# EAGLE design Carrier Board (EAGLE 9.4.0)

## Sheet 1 of 3: Sensors
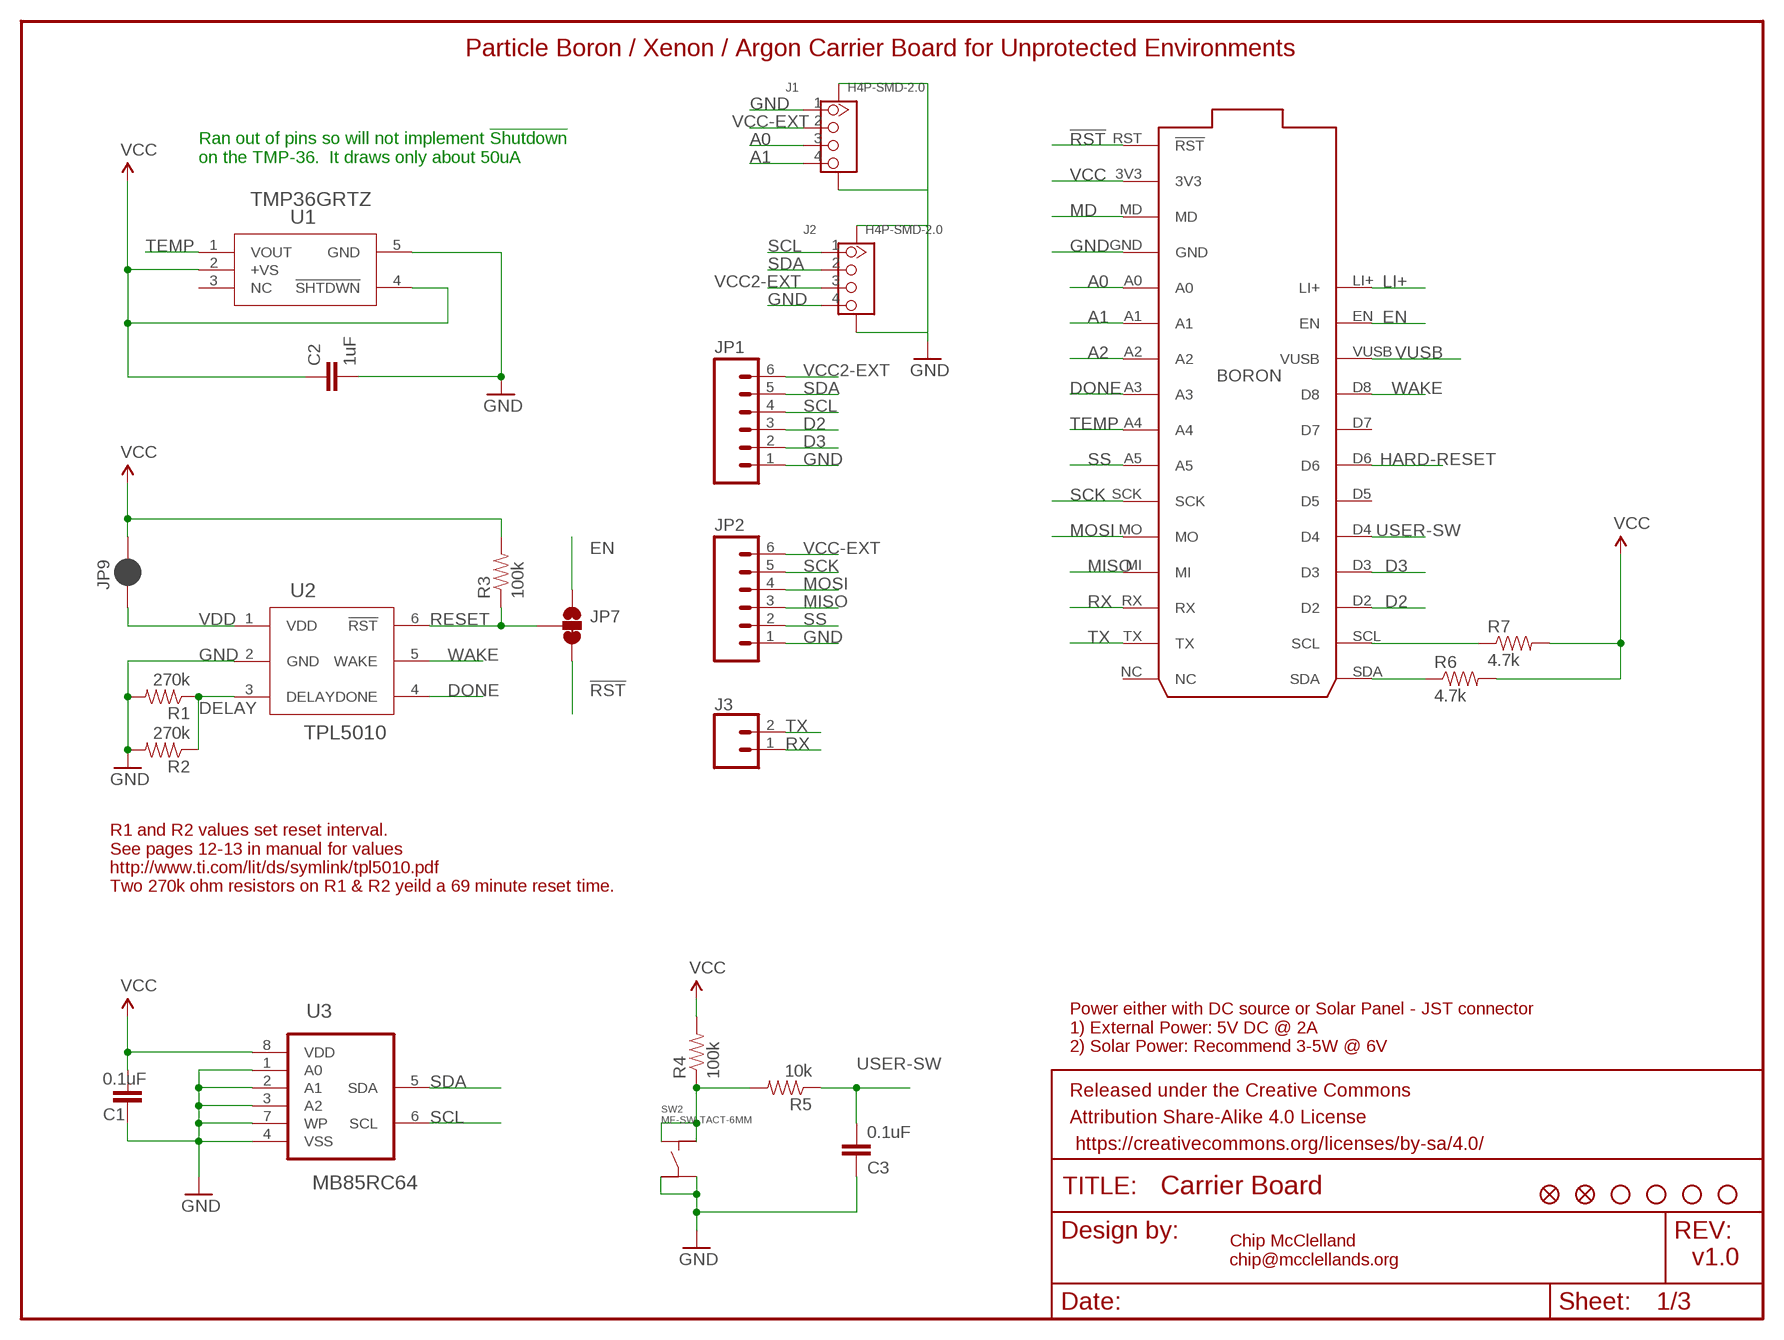
[diagram p0: schematic, sheet 1]

### Parts
BORON/ARGON/XENON  PARTICLE-DEVICES-BORON  [PARTICLE-DEVICES_BORON]
C1  0.1uF  CAP0805  [0805@1]
C2  1uF  CAP0805  [0805@1]
C3  0.1uF  CAP0805  [0805@1]
FD1  FIDUCIALUFIDUCIAL  [FIDUCIAL-MICRO]
FD2  FIDUCIALUFIDUCIAL  [FIDUCIAL-MICRO]
FRAME1  FRAME-LETTER  [CREATIVE_COMMONS]
J1  H4P-SMD-2.0  GROVE-CONNECTOR-SMD(4+2P-2.0)  [HW4-SMD-2.0]
J2  H4P-SMD-2.0  GROVE-CONNECTOR-SMD(4+2P-2.0)  [HW4-SMD-2.0]
J3  CONN_02  [1X02]
JP1  M06LOCK  [1X06_LOCK]
JP2  M06LOCK  [1X06_LOCK]
JP3  STAND-OFF  [STAND-OFF]
JP4  STAND-OFF  [STAND-OFF]
JP5  STAND-OFF  [STAND-OFF]
JP6  STAND-OFF  [STAND-OFF]
JP7  JUMPER-SMT_3_1-NC_TRACE_SILK  [SMT-JUMPER_3_1-NC_TRACE_SILK]
JP9  JUMPER-SMT_2_NC_PASTE_SILK  [SMT-JUMPER_2_NC_PASTE_SILK]
R1  270k  RESISTOR0805-RES  [0805]
R2  270k  RESISTOR0805-RES  [0805]
R3  100k  RESISTOR0805-RES  [0805]
R4  100k  RESISTOR0805-RES  [0805]
R5  10k  RESISTOR0805-RES  [0805]
R6  4.7k  RESISTOR0805-RES  [0805]
R7  4.7k  RESISTOR0805-RES  [0805]
SW2  MF-SW-TACT-6MM  TACT_6MM  [TACT6MM]
U1  TMP36GRTZ  TMP36GRTZ-REEL7  [RJ_5]
U2  TPL5010  [TSOT-23]
U3  MB85RC64  MB85RC128PNF-G-JNE1  [SOIC127P600X175-8N]

### Nets
!RST: BORON/ARGON/XENON.RST(!RST) JP7.3
A0: BORON/ARGON/XENON.A0 J1.3
A1: BORON/ARGON/XENON.A1 J1.4
A2: BORON/ARGON/XENON.A2
D2: BORON/ARGON/XENON.D2 JP1.3 ; also sheet 3
D3: BORON/ARGON/XENON.D3 JP1.2 ; also sheet 3
DELAY: R1.1 R2.1 U2.3(DELAY)
DONE: BORON/ARGON/XENON.A3 U2.4(DONE)
EN: BORON/ARGON/XENON.EN JP7.1 ; also sheet 2
GND: BORON/ARGON/XENON.GND C1.2 C2.2 C3.2 J1.1 J1.SS1 J1.SS2 J2.4 J2.SS1 J2.SS2 JP1.1 JP2.1 R1.2 R2.2 SW2.P$3 SW2.P$4 U1.5(GND) U2.2(GND) U3.1(A0) U3.2(A1) U3.3(A2) U3.4(VSS) U3.7(WP) ; also sheet 2,3
HARD-RESET: BORON/ARGON/XENON.D6 ; also sheet 2
LI+: BORON/ARGON/XENON.LI+ ; also sheet 2,3
MD: BORON/ARGON/XENON.MD
MISO: BORON/ARGON/XENON.MI JP2.3
MOSI: BORON/ARGON/XENON.MO JP2.4
N$4: R4.1 R5.2 SW2.P$1 SW2.P$2
RESET: JP7.2 R3.1 U2.6(!RST)
RX: BORON/ARGON/XENON.RX J3.1
SCK: BORON/ARGON/XENON.SCK JP2.5
SCL: BORON/ARGON/XENON.SCL J2.1 JP1.4 R7.1 U3.6(SCL) ; also sheet 3
SDA: BORON/ARGON/XENON.SDA J2.2 JP1.5 R6.1 U3.5(SDA) ; also sheet 3
SS: BORON/ARGON/XENON.A5 JP2.2
TEMP: BORON/ARGON/XENON.A4 U1.1(VOUT)
TX: BORON/ARGON/XENON.TX J3.2
USER-SW: BORON/ARGON/XENON.D4 C3.1 R5.1
VCC: BORON/ARGON/XENON.3V3 C1.1 C2.1 JP9.2 R3.2 R4.2 R6.2 R7.2 U1.2(+VS) U1.4(!SHTDWN) U3.8(VDD) ; also sheet 3
VCC2-EXT: J2.3 JP1.6 ; also sheet 3
VCC-EXT: J1.2 JP2.6 ; also sheet 3
VDD: JP9.1 U2.1(VDD)
VUSB: BORON/ARGON/XENON.VUSB ; also sheet 2,3
WAKE: BORON/ARGON/XENON.D8 U2.5(WAKE)
Unconnected: BORON/ARGON/XENON.D5 BORON/ARGON/XENON.D7 BORON/ARGON/XENON.NC U1.3(NC)

### Notes on the sheet
- Particle Boron / Xenon / Argon Carrier Board for Unprotected Environments
- Ran out of pins so will not implement !Shutdown
  on the TMP-36.  It draws only about 50uA
- R1 and R2 values set reset interval.
  See pages 12-13 in manual for values
  http://www.ti.com/lit/ds/symlink/tpl5010.pdf
  Two 270k ohm resistors on R1 & R2 yeild a 69 minute reset time.
- Power either with DC source or Solar Panel - JST connector
  1) External Power: 5V DC @ 2A 
  2) Solar Power: Recommend 3-5W @ 6V
- Chip McClelland
  chip@mcclellands.org
- v1.0

## Sheet 2 of 3: Power Control
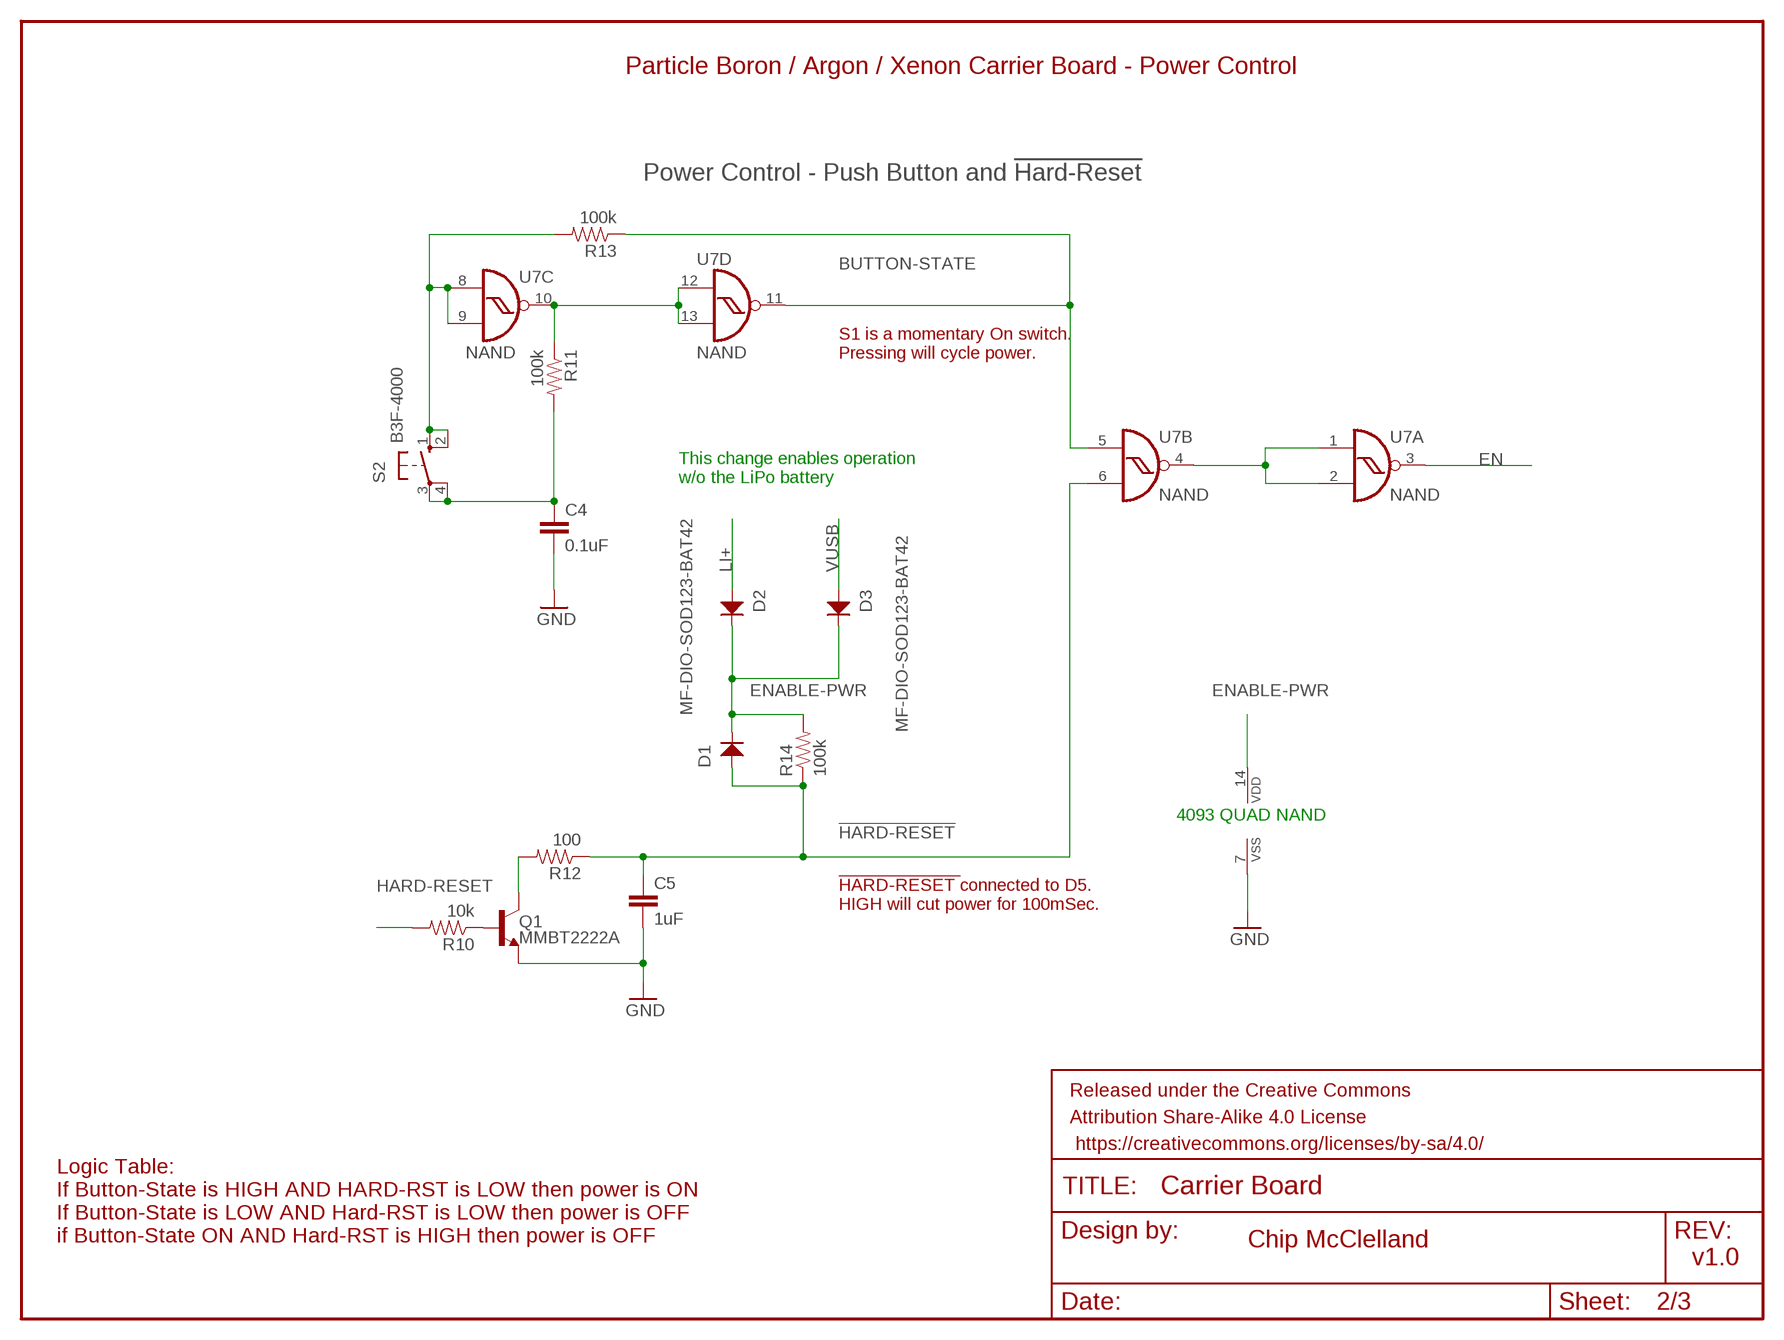
[diagram p1: schematic, sheet 2]

### Parts
C4  0.1uF  CAP0805  [0805@1]
C5  1uF  CAP0805  [0805@1]
D1  MF-DIO-SOD123-BAT42  DIODES_BAT42_SOD-123  [SOD-123]
D2  MF-DIO-SOD123-BAT42  DIODES_BAT42_SOD-123  [SOD-123]
D3  MF-DIO-SOD123-BAT42  DIODES_BAT42_SOD-123  [SOD-123]
FRAME2  FRAME-LETTER  [CREATIVE_COMMONS]
Q1  MMBT2222A  TRANS_NPN-MMBT2222AL  [SOT23-3]
R10  10k  RESISTOR0805-RES  [0805]
R11  100k  RESISTOR0805-RES  [0805]
R12  100  RESISTOR0805-RES  [0805]
R13  100k  RESISTOR0805-RES  [0805]
R14  100k  RESISTOR0805-RES  [0805]
S2  B3F-4000  40-XX-ROUND  [B3F-40XX-ROUND]
U7  NAND  4093DT  [MC14093B-TSSOP14]

### Nets
!HARD-RESET: C5.1 D1.ANODE R12.1 R14.1 U7.6(B:I1)
BUTTON-STATE: R13.1 U7.5(B:I0) U7.11(D:O)
EN: U7.3(A:O) ; also sheet 1
ENABLE-PWR: D1.CATHODE D2.CATHODE D3.CATHODE R14.2 U7.14(P:VDD)
GND: C4.2 C5.2 Q1.2(E) U7.7(P:VSS) ; also sheet 1,3
HARD-RESET: R10.2 ; also sheet 1
LI+: D2.ANODE ; also sheet 1,3
N$1: U7.1(A:I0) U7.2(A:I1) U7.4(B:O)
N$14: R11.1 U7.10(C:O) U7.12(D:I0) U7.13(D:I1)
N$16: Q1.1(B) R10.1
N$19: Q1.3(C) R12.2
N$24: C4.1 R11.2 S2.3(P) S2.4(P1)
N$25: R13.2 S2.1(S) S2.2(S1) U7.8(C:I0) U7.9(C:I1)
VUSB: D3.ANODE ; also sheet 1,3

### Notes on the sheet
- Particle Boron / Argon / Xenon Carrier Board - Power Control
- Power Control - Push Button and !Hard-Reset
- S1 is a momentary On switch.
  Pressing will cycle power.
- This change enables operation 
  w/o the LiPo battery
- 4093 QUAD NAND
- !HARD-RESET !connected to D5. 
  HIGH will cut power for 100mSec.
- Chip McClelland
- Logic Table:
  If Button-State is HIGH AND HARD-RST is LOW then power is ON
  If Button-State is LOW AND Hard-RST is LOW then power is OFF
  if Button-State ON AND Hard-RST is HIGH then power is OFF
- v1.0

## Sheet 3 of 3: Protection and 5V Boost
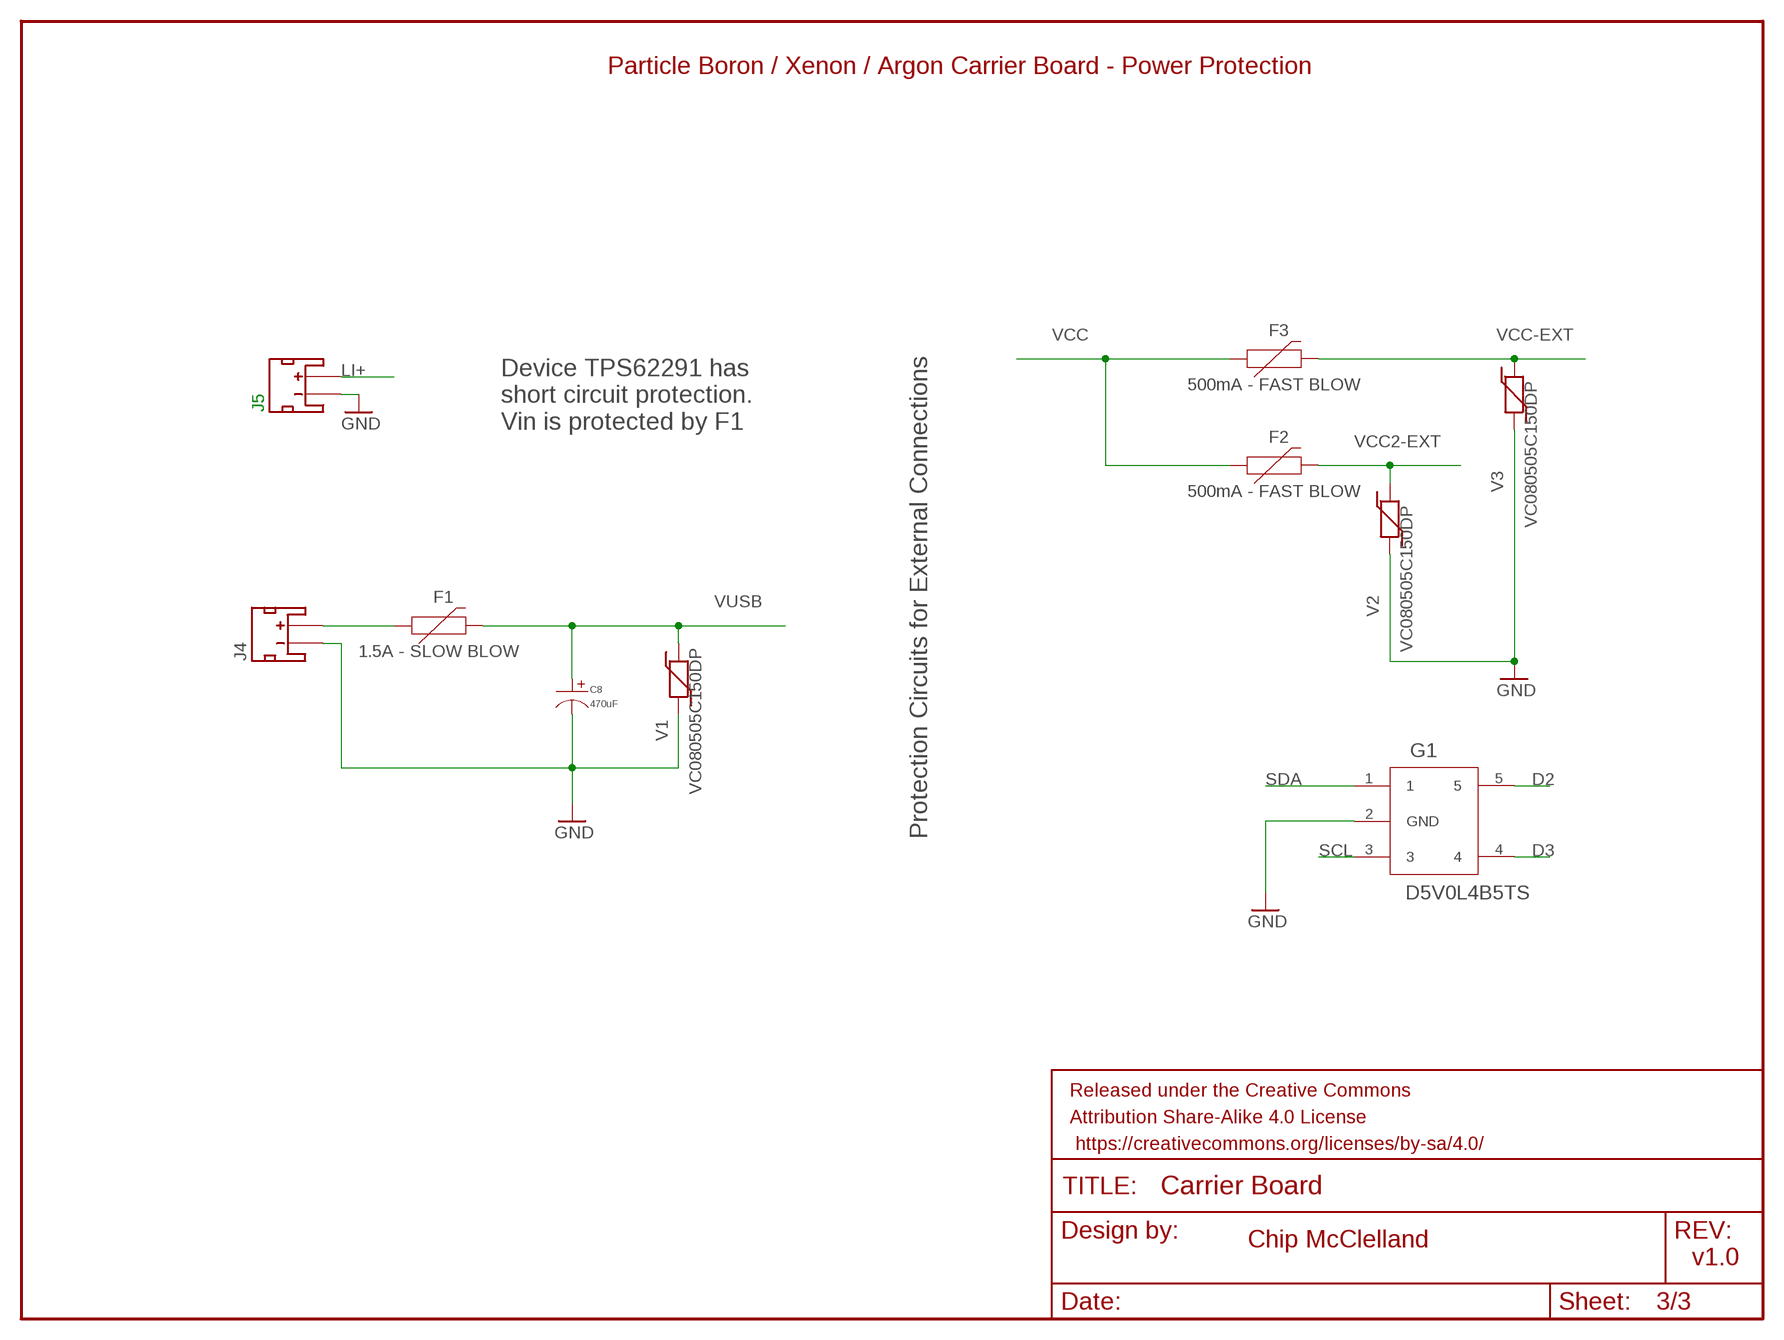
[diagram p2: schematic, sheet 3]

### Parts
C8  470uF  CAPACITOR_P_10MM  [CP10MM]
F1  1.5A - SLOW BLOW  PPTC_HALF-AMP  [1206]
F2  500mA - FAST BLOW  PPTC_HALF-AMP  [1206]
F3  500mA - FAST BLOW  PPTC_HALF-AMP  [1206]
FRAME3  FRAME-LETTER  [CREATIVE_COMMONS]
G1  D5V0L4B5TS  [SOT-23-5]
J4  S2B-PH-SM4-TB(LF)(SN)  JST_2MM_MALE  [JST-2-SMD]
J5  S2B-PH-SM4-TB(LF)(SN)  JST_2MM_MALE  [JST-2-SMD]
V1  VC080505C150DP  VARISTOR  [0805]
V2  VC080505C150DP  VARISTOR  [0805]
V3  VC080505C150DP  VARISTOR  [0805]

### Nets
D2: G1.5 ; also sheet 1
D3: G1.4 ; also sheet 1
DC-IN-EXT: F1.1 J4.2(+)
GND: C8.P$2 G1.2(GND) J4.1(-) J5.1(-) V1.1 V2.1 V3.1 ; also sheet 1,2
LI+: J5.2(+) ; also sheet 1,2
SCL: G1.3 ; also sheet 1
SDA: G1.1 ; also sheet 1
VCC: F2.1 F3.1 ; also sheet 1
VCC2-EXT: F2.2 V2.2 ; also sheet 1
VCC-EXT: F3.2 V3.2 ; also sheet 1
VUSB: C8.P$1 F1.2 V1.2 ; also sheet 1,2
Unconnected: J4.NC1(PAD1) J4.NC2(PAD2) J5.NC1(PAD1) J5.NC2(PAD2)

### Notes on the sheet
- Particle Boron / Xenon / Argon Carrier Board - Power Protection
- Device TPS62291 has 
  short circuit protection. 
  Vin is protected by F1
- Protection Circuits for External Connections
- Chip McClelland
- v1.0

## Library data of the parts
BORON/ARGON/XENON = Carrier Board:PARTICLE-DEVICES-BORON: Particle Boron Device for Carrier Board Placement
C1-C5 = SparkFun-Capacitors:CAP: Capacitor Standard 0603 ceramic capacitor, and 0.1" leaded capacitor.
C8 = MF_Passives:CAPACITOR_P: Library: MF_Passives Description: Device for Polarized Capacitors. Manufacture part number (MPN), Voltage Rating, and Tolerance can be added via Attributes. Check https://factory.macrofab.com/parts for the house parts list.; POPULATE: 1
D1-D3 = MF_Discrete_Semiconductor:DIODES: Library: MF_Discrete_Semiconductor Description: Device for Single Packaged Diodes.; HOUSEPART: YES; MPN: MF-DIO-SOD123-BAT42; POPULATE: 1; URL: https://factory.macrofab.com/part/MF-DIO-SOD123-BAT42
F1-F3 = SparkFun-Fuses:PPTC: Resettable Fuse PPTC Resettable Fuse. Really a sort of resistor with a polymeric positive temperature coefficient whose resistance increases dramatically with an increase in temperature. When heated by the power passing through the resistance rises causing the current to be limited, protecting the circuit. This is achieved by the transition of the polymer from a crystalline to an amorphous state where the conductive carbon separates breaking the conductive pathways found in the cool crystalline structure. When a PPTC cools back down it resumes conducting letting the circuit turn back on. SparkFun Products: SparkFun RedBoard - Programmed with Arduino <https://www.sparkfun.com/products/12757> Pro Micro - 5V/16MHz <https://www.sparkfun.com/products/12640> Arduino Pro 328 - 5V/16MHz <https://www.sparkfun.com/products/10915> MP3 Trigger <https://www.sparkfun.com/products/13720>; PROD_ID: RES-08585; VALUE: 6V/0.5A
FD1 FD2 = SparkFun-Aesthetics:FIDUCIAL: Fiducial Alignment Points Point-of-reference for pick-and-place machines and other optical instruments.
FRAME1-FRAME3 = SparkFun-Aesthetics:FRAME-LETTER: Schematic Frame - Letter Standard 8.5x11 US Letter frame
G1 = Custom Components:D5V0L4B5TS: 4 CHANNEL LOW CAPACITANCE BI-DIRECTIONAL TVS ARRAY
J1 J2 = OPL_Connector:GROVE-CONNECTOR-SMD(4+2P-2.0): 320110030
J3 = SparkFun-Connectors:CONN_02: Multi connection point. Often used as Generic Header-pin footprint for 0.1 inch spaced/style header connections On any of the 0.1 inch spaced packages, you can populate with these: Break Away Headers - Straight <https://www.sparkfun.com/products/116> (PRT-00116) Break Away Male Headers - Right Angle <https://www.sparkfun.com/products/553> (PRT-00553) Female Headers <https://www.sparkfun.com/products/115> (PRT-00115) Break Away Headers - Machine Pin <https://www.sparkfun.com/products/117> (PRT-00117) Break Away Female Headers - Swiss Machine Pin <https://www.sparkfun.com/products/743> (PRT-00743) For SCREWTERMINALS and SPRING TERMINALS visit here: Screw Terimnals on SparkFun.com <https://www.sparkfun.com/search/results?term=Screw+Terminals> (5mm/3.5mm/2.54mm spacing) This device is also useful as a general connection point to wire up your design to another part of your project. Our various solder wires solder well into these plated through hole pads. Hook-Up Wire - Assortment (Stranded, 22 AWG) <https://www.sparkfun.com/products/11375> (PRT-11375) Hook-Up Wire - Assortment (Solid Core, 22 AWG) <https://www.sparkfun.com/products/11367> (PRT-11367) View the entire wire category on our website here <https://www.sparkfun.com/categories/141> Special notes: Molex polarized connector foot print use with: PRT-08233 with associated crimp pins and housings. 2.54_SCREWTERM for use with PRT-10571. 3.5mm Screw Terminal footprints for PRT-08084 5mm Screw Terminal footprints for use with PRT-08432
J4 J5 = SparkFun-Connectors:JST_2MM_MALE: JST 2MM MALE RA CONNECTOR Two pin, compact surface mount connector. Commonly used as a battery input connection point. We really like the solid locking feeling and high current rating on these small connectors. We use these all the time as battery connectors. Mates to single-cell LiPo batteries. Here is the connector we sell at SparkFun: JST Right Angle Connector - White <https://www.sparkfun.com/products/8612> (PRT-08612) Datasheet <http://www.sparkfun.com/datasheets/Prototyping/Connectors/JST-Horizontal.pdf> It was used on these SparkFun products: SparkFun MOSFET Power Controller <https://www.sparkfun.com/products/11214> (PRT-11214) SparkFun Battery Babysitter - LiPo Battery Manager <https://www.sparkfun.com/products/13777> (PRT-13777) And many, many others that required a lipo battery connection.; MFG: S2B-PH-SM4-TB(LF)(SN); PROD_ID: CONN-11443; SF_ID: PRT-08612
JP1 JP2 = SparkFun-Connectors:M06: Header 6 Standard 6-pin 0.1" header. Use with straight break away headers (SKU : PRT-00116), right angle break away headers (PRT-00553), swiss pins (PRT-00743), machine pins (PRT-00117), and female headers (PRT-00115). Molex polarized connector foot print use with SKU : PRT-08094 with associated crimp pins and housings. NOTES ON THE VARIANTS LOCK and LOCK_LONGPADS... This footprint was designed to help hold the alignment of a through-hole component (i.e. 6-pin header) while soldering it into place. You may notice that each hole has been shifted either up or down by 0.005 of an inch from it's more standard position (which is a perfectly straight line). This slight alteration caused the pins (the squares in the middle) to touch the edges of the holes. Because they are alternating, it causes a "brace" to hold the component in place. 0.005 has proven to be the perfect amount of "off-center" position when using our standard breakaway headers. Although looks a little odd when you look at the bare footprint, once you have a header in there, the alteration is very hard to notice. Also,if you push a header all the way into place, it is covered up entirely on the bottom side. This idea of altering the position of holes to aid alignment will be further integrated into the Sparkfun Library for other footprints. It can help hold any component with 3 or more connection pins.
JP3-JP6 = SparkFun:STAND-OFF: Stand Off This is the mechanical footprint for a #4 phillips button head screw. Use the keepout ring to avoid running the screw head into surrounding components. SKU : PRT-00447
JP7 = SparkFun-Jumpers:JUMPER-SMT_3_1-NC_TRACE: Normally closed trace jumper (1 of 2 connections) This jumper has a trace between two pads so it's normally closed (NC). The other connection is normally open (NO). Use a razor knife to open the connection. For best results follow the IPC guidelines for cutting traces: Cutout at least 0.063 mm (0.005 in). Remove all loose material to clean up the cut area. Seal the cut with an approved epoxy. Reapply solder to reclose the connection, or to close the NO connection.
JP9 = SparkFun-Jumpers:JUMPER-SMT_2_NC_PASTE: Normally closed solder jumper This jumper has an aperture in the stencil to allow solder paste to bridge the split in the wire so it's normally closed (NC). Wick off the solder to open the connection. Reapply solder to reclose the connection.
Q1 = SparkFun-DiscreteSemi:TRANS_NPN: NPN transistor Current controlled devices typically used to amplify current or used as a switch. BC547 - COM-08928 <http://www.sparkfun.com/products/8928> (TO-92 45V 100mA) (1.Collector 2.Base 3.Emitter) 2N3904 - COM-00521 <http://www.sparkfun.com/products/521> (TO-92 40V 200mA) (1.Emitter 2.Base 3.Collector) P2N2222A - COM-12852 <http://www.sparkfun.com/products/12852> (TO-92 40V 600mA) (1.Collector 2.Base 3.Emitter); PROD_ID: TRANS-08049; VALUE: 600mA/40V
R1-R7 R10-R14 = SparkFun-Passives:RESISTOR: Resistor Basic schematic elements and footprints for 0603, 1206, and PTH resistors.
S2 = adafruit:40-XX: OMRON SWITCH
SW2 = MF_Switches:TACT: Library: MF_Switches Description: Device for Tact Switches. Manufacture part number (MFG#) can be added via Attributes.; HOUSEPART: YES; MPN: MF-SW-TACT-6MM; POPULATE: 1; URL: https://factory.macrofab.com/part/MF-SW-TACT-6MM
U1 = TMP36:TMP36GRTZ-REEL7; MANUFACTURER_PART_NUMBER: TMP36GRTZREEL7; VENDOR: Analog Devices Inc
U2 = Custom Components:TPL5010: This is a TI Ultra-Low-Power External watchdog.
U3 = Fujitsu_By_element14_Batch_1:MB85RC128PNF-G-JNE1: Memory FRAM; MPN: MB85RC128PNF-G-JNE1; OC_FARNELL: 1831995; OC_NEWARK: 93R5161; PACKAGE: SO-8; SUPPLIER: FUJITSU
U7 = adafruit:4093: Quad 2-input NAND schmitt trigger
V1-V3 = Custom Components:VARISTOR

## Net classes
0 default: width 0.203 mm, drill 0.33 mm

## Board
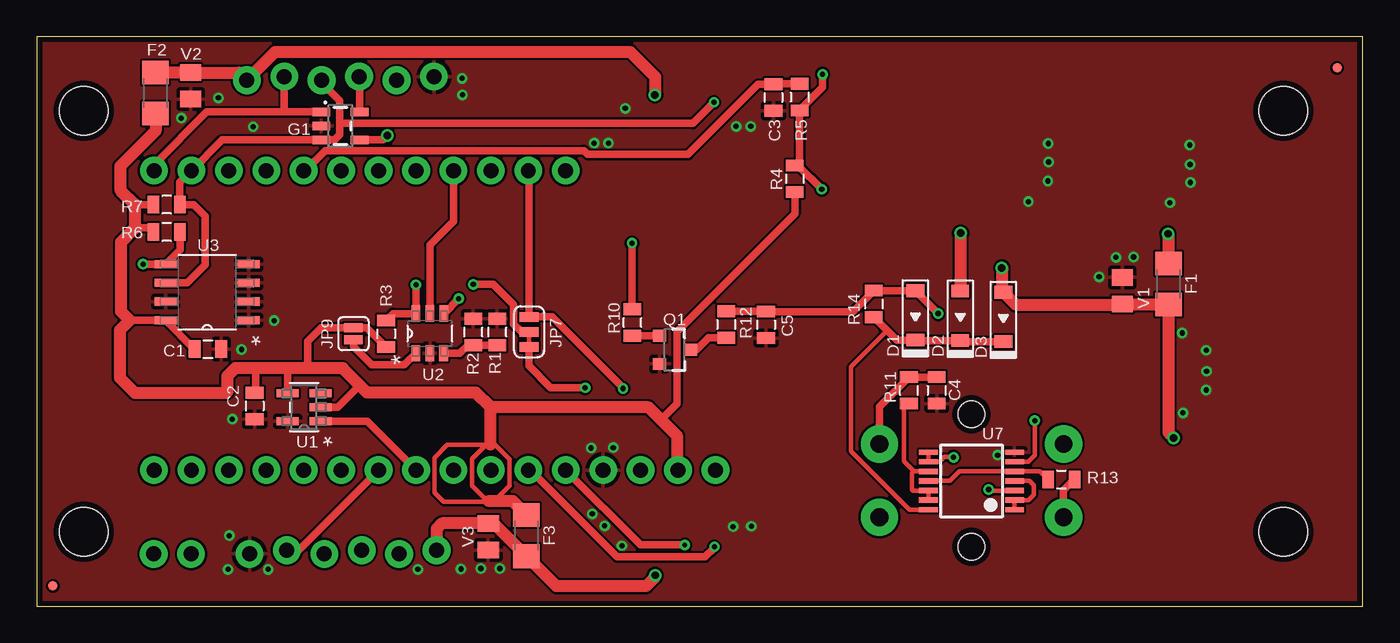
[diagram p3: board, top side]
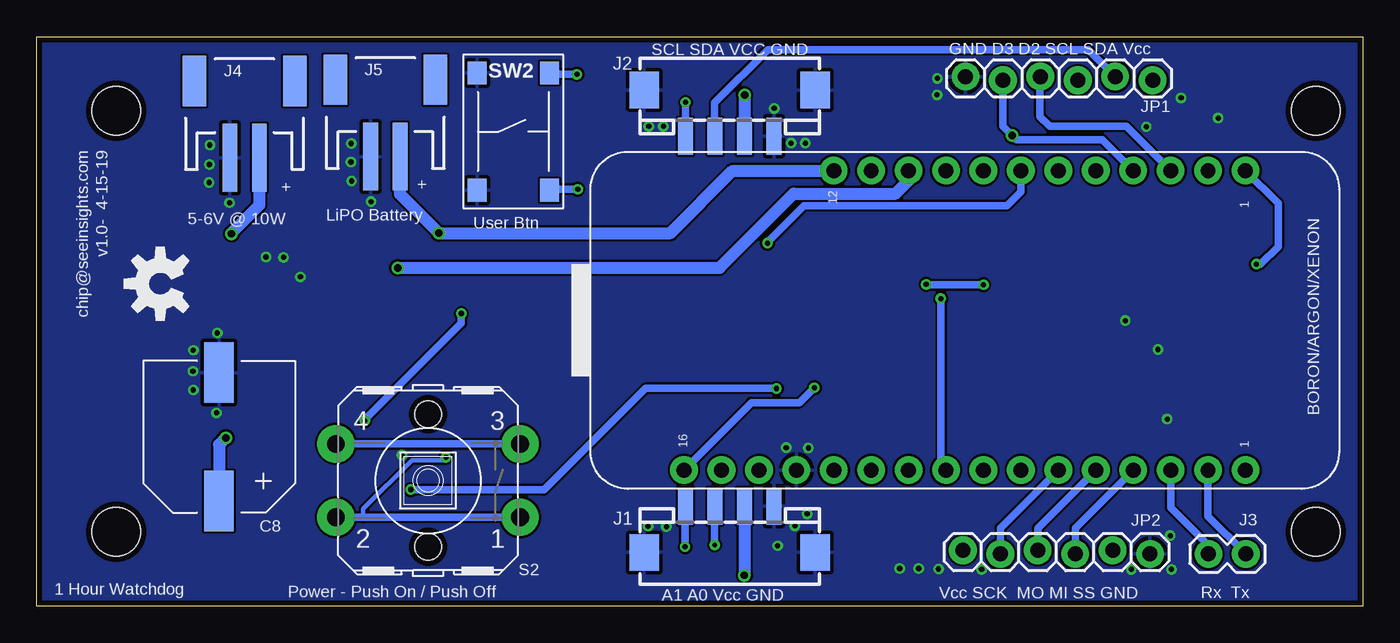
[diagram p4: board, bottom side, seen from below]

Size 89.97 x 38.61 mm. Coordinates in mm from the lower left corner, seen from the top.
Outline: 0,0 89.97,0 89.97,38.61 0,38.61 0,0
Copper layers (1*16): Top 0.0356mm / dielectric 1.5011mm / Bottom 0.0356mm
Design rules "LaenPCBOrder": minimum track width 6mil, minimum drill 13mil, track to track 6mil, track to pad 6mil, pad to pad 6mil, via to via 6mil, smd to smd 6mil, copper to edge 15mil, drill to drill 6mil, minimum pad ring 7mil, minimum via ring 7mil, stop-mask expansion 3mil, vias tented up to drill 0mil, thermal gap 10mil

### Footprints (pad centres in the part's own frame; a part is rotated, then mirrored left to right if it is on the bottom)
PARTICLE-DEVICES_BORON = drill 1.016 pad 1.88: 3V3 1.27,41.91; A0 1.27,34.29; A1 1.27,31.75; A2 1.27,29.21; A3 1.27,26.67; A4 1.27,24.13; A5 1.27,21.59; D2 21.59,11.43; D3 21.59,13.97; D4 21.59,16.51; D5 21.59,19.05; D6 21.59,21.59; D7 21.59,24.13; D8 21.59,26.67; EN 21.59,31.75; GND 1.27,36.83; LI+ 21.59,34.29; MD 1.27,39.37; MI 1.27,13.97; MO 1.27,16.51; NC 1.27,6.35; RST 1.27,44.45; RX 1.27,11.43; SCK 1.27,19.05; SCL 21.59,8.89; SDA 21.59,6.35; TX 1.27,8.89; VUSB 21.59,29.21
0805@1 = smd 0.8 x 1.2: 1 -0.9,0; 2 0.9,0
CP10MM = smd 2 x 4.1: P$1 0,-4.35; P$2 0,4.35
SOD-123 = smd 0.85 x 1.2: ANODE 1.675,0; CATHODE -1.675,0
1206 = smd 1.6 x 1.8: 1 -1.4,0; 2 1.4,0
FIDUCIAL-MICRO = smd 0.635 x 0.635: 1 0,0
SOT-23-5 = smd 0.55 x 1.2: 1 -0.95,-1.3; 2 0,-1.3; 3 0.95,-1.3; 4 0.95,1.3; 5 -0.95,1.3
HW4-SMD-2.0 = smd 1 x 2.5: 1 -3,0; 2 -1,0; 3 1,0; 4 3,0 | smd 2 x 2.5: SS1 -5.8,3.123; SS2 5.8,3.123
1X02 = drill 1.016 pad 1.88: 1 0,0; 2 2.54,0
JST-2-SMD = smd 1 x 4.6: 1 -1,-3.7; 2 1,-3.7 | smd 1.6 x 3.4: NC1 -3.4,1.5; NC2 3.4,1.5
1X06_LOCK = drill 1.016 pad 1.88: 1 0,0; 2 2.54,-0.254; 3 5.08,0; 4 7.62,-0.254; 5 10.16,0; 6 12.7,-0.254
STAND-OFF = hole 3.302: 0,0
SMT-JUMPER_3_1-NC_TRACE_SILK = smd 0.635 x 1.27: 1 -1.016,0; 2 0,0; 3 1.016,0
SMT-JUMPER_2_NC_PASTE_SILK = smd 0.635 x 1.27: 1 -0.406,0; 2 0.406,0
SOT23-3 = smd 0.8 x 0.9: 1 -0.95,-1; 2 0.95,-1; 3 0,1.1
0805 = smd 0.8 x 1.2: 1 -0.9,0; 2 0.9,0
B3F-40XX-ROUND = drill 1.194 pad 2.54: 1 -6.248,2.489; 2 6.248,2.489; 3 -6.248,-2.489; 4 6.248,-2.489 | hole 1.803: 0,-4.496; 0,4.496
TACT6MM = smd 1.55 x 1.3: P$1 -3.975,2.45; P$2 3.975,2.45; P$3 -3.975,-2.45; P$4 3.975,-2.45
RJ_5 = smd 1.473 x 0.559: 1 -1.118,0.95; 2 -1.118,0; 3 -1.118,-0.95; 4 1.118,-0.95; 5 1.118,0.95
TSOT-23 = smd 1.1 x 0.6: 1 -1.35,0.95; 2 -1.35,0; 3 -1.35,-0.94; 4 1.35,-0.95; 5 1.35,0; 6 1.35,0.95
SOIC127P600X175-8N = smd 1.473 x 0.559: 1 -2.819,1.905; 2 -2.819,0.635; 3 -2.819,-0.635; 4 -2.819,-1.905; 5 2.819,-1.905; 6 2.819,-0.635; 7 2.819,0.635; 8 2.819,1.905
MC14093B-TSSOP14 = smd 0.36 x 1.26: 1 -1.95,-2.925; 2 -1.3,-2.925; 3 -0.65,-2.925; 4 0,-2.925; 5 0.65,-2.925; 6 1.3,-2.925; 7 1.95,-2.925; 8 1.95,2.925; 9 1.3,2.925; 10 0.65,2.925; 11 0,2.925; 12 -0.65,2.925; 13 -1.3,2.925; 14 -1.95,2.925
0805' = smd 1.118 x 1.448: 1 -0.902,0; 2 0.902,0

### Placement (x,y rotation side)
BORON/ARGON/XENON  1.6,7.95 90 bottom
C1  11.61,17.42 0 top
C2  14.78,13.56 270 top
C3  49.99,34.49 270 top
C4  61.06,14.63 270 top
C5  49.48,19.08 270 top
C8  77.6,11.48 0 bottom
D1  59.61,19.71 90 top
D2  62.66,19.68 90 top
D3  65.58,19.61 90 top
F1  76.78,21.84 270 top
F2  8.05,34.8 90 top
F3  33.22,4.78 270 top
FD1  88.24,36.5 0 top
FD2  1.09,1.37 0 top
FRAME1  0.03,-11.81 0 top  (outside the outline)
FRAME2  0.03,-20.29 0 top  (outside the outline)
FRAME3  0.03,-28.78 0 top  (outside the outline)
G1  20.6,32.56 270 top
J1  42.95,6.76 180 bottom
J2  42.95,31.88 0 bottom
J3  10.46,3.53 0 bottom
J4  75.87,34.11 0 bottom
J5  66.32,34.19 0 bottom
JP1  26.95,35.92 0 bottom
JP2  14.43,3.53 180 bottom
JP3  84.58,33.6 0 top
JP4  84.58,5.03 90 top
JP5  3.17,33.6 0 top
JP6  3.17,5.03 0 top
JP7  33.4,18.59 270 top
JP9  21.49,18.47 90 top
Q1  43.26,17.37 270 top
R1  31.24,18.59 90 top
R2  29.62,18.59 90 top
R3  23.7,18.47 270 top
R4  51.44,28.98 270 top
R5  51.77,34.52 270 top
R6  8.81,25.37 180 top
R7  8.81,27.23 180 top
R10  40.41,19.23 90 top
R11  59.18,14.63 90 top
R12  46.79,19.1 270 top
R13  69.52,8.59 0 top
R14  56.79,20.5 270 top
S2  63.42,8.51 180 bottom
SW2  57.63,32.18 270 bottom
U1  18.14,13.49 180 top
U2  26.67,18.49 90 top
U3  11.56,21.29 180 top
U7  63.42,8.48 90 top
U$2  [OSHW-LOGO-M]  81.58,21.87 90 bottom
V1  VC080505C150DP  [0805']  73.66,21.39 270 top
V2  VC080505C150DP  [0805']  10.44,35.28 90 top
V3  VC080505C150DP  [0805']  30.63,4.7 90 top

### Tracks (layer width: path | path; a pad name or v marks a point on that pad's centre or on a via)
!HARD-RESET  (via drill 0.35)
  Top 0.305: U7.6 67.29,9.78 67.72,10.21 v67.72,12.57
  Top 0.508: R12.1 49.45,20 C5.1 55.37,19.98 R14.1 D1.ANODE v61.16,19.84
  Bottom 0.508: v61.16,19.84 61.16,19.18 67.72,12.62 v67.72,12.57
!RST  (via drill 0.35)
  Top 0.305: 33.4,17.48 JP7.3
  Top 0.508: v37.21,14.81 34.87,14.81 33.4,16.28 33.4,17.48
  Bottom 0.508: BORON/ARGON/XENON.RST 41.48,13.79 38.23,13.79 v37.21,14.81
A0  (via drill 0.33)
  Top 0.508: v43.97,4.14 40.95,4.14 35.89,9.2 BORON/ARGON/XENON.A0
  Bottom 0.508: v43.97,4.14 43.97,6.74 J1.3
A1  (via drill 0.33)
  Top 0.508: BORON/ARGON/XENON.A1 33.5,9.22 39.39,3.33 45.34,3.33 45.97,3.96 v45.97,4.01
  Bottom 0.508: v45.97,4.01 45.97,6.73 J1.4
BUTTON-STATE
  Top 0.305: U7.11 61.95,8.48 62.6,9.13 U7.5 68.07,9.13 R13.1
D2
  Top 0.508: G1.5 21.9,35.89 JP1.3
  Bottom 0.508: BORON/ARGON/XENON.D2 16.03,32.54 21.23,32.54 21.89,33.2 21.89,35.89 JP1.3
D3  (via drill 0.5)
  Top 0.508: G1.4 23.51,31.61 23.77,31.88 v23.77,31.91
  Bottom 0.508: JP1.2 24.41,32.54 v23.77,31.91 23.49,31.62 17.65,31.62 BORON/ARGON/XENON.D3
DC-IN-EXT  (via drill 0.5)
  Top 0.813: v76.76,25.25 76.78,25.22 F1.1
  Bottom 0.813: J4.2 74.87,27.19 76.78,25.27 v76.76,25.25
DELAY
  Top 0.508: R1.1 R2.1 29.25,17.69 28.7,17.14 U2.3
DONE  (via drill 0.35)
  Top 0.508: U2.4 28.61,20.83 28.63,20.83 v28.63,20.85
  Bottom 0.508: v28.63,20.85 28.63,9.58 BORON/ARGON/XENON.A3
EN  (via drill 0.35)
  Top 0.305: v64.59,7.9 64.66,7.83 U7.3
  Top 0.508: v39.78,14.76 39.83,14.76 34.98,19.61 JP7.1 33.4,29.49 BORON/ARGON/XENON.EN
  Bottom 0.508: v39.78,14.76 48.67,14.76 55.55,7.87 64.59,7.87 v64.59,7.9
ENABLE-PWR
  Top 0.305: U7.14 59.2,6.53 55.24,10.49 55.24,16.23 57.69,18.68 57.72,18.68
  Top 0.508: D3.CATHODE 62.74,17.93 D2.CATHODE 59.64,18.01 D1.CATHODE 58.36,18.04 57.72,18.68 R14.2
GND  (via drill 0.35)
  other vias: 48.49,5.41 38.53,5.44 13.06,4.78 15.7,2.49 79.35,17.35 79.38,15.93 79.35,14.66 77.77,13.11 77.72,18.52 78.23,31.27 78.26,29.95 78.28,28.73 76.89,27.36 68.63,31.37 68.66,30.12 68.61,28.83 67.28,27.43 12.32,34.47 9.8,33.1 14.68,32.51 38.79,31.39 28.88,34.67 39.12,10.74 37.62,10.72 30.12,2.54 25.86,2.49 39.7,4.09 47.24,5.38 65.2,10.24 73.23,23.65 74.42,23.67 72.09,22.33 13.89,17.4 16.1,19.35 13.26,12.67 28.78,2.51 31.42,2.54 12.98,2.49 28.85,35.79 47.45,32.54 48.44,32.54 39.93,33.76 37.82,31.39 37.69,6.25
  pour Top (rank 2): -3.78,42.94 97.47,43.13 97.41,-1.99 -3.78,-2.18
  pour Bottom: -3.57,40.96 97.01,40.8 96.82,-2.41 -3.38,-2.39
HARD-RESET  (via drill 0.35)
  Top 0.508: v40.39,24.61 40.39,20.15 R10.2
  Bottom 0.508: BORON/ARGON/XENON.D6 23.19,28.12 24.16,27.15 37.9,27.15 40.39,24.66 v40.39,24.61
LI+  (via drill 0.5)
  Top 0.813: v62.69,25.3 62.69,21.39 D2.ANODE
  Bottom 0.813: J5.2 65.33,30.48 65.33,27.94 v62.69,25.3 46.97,25.3 42.75,29.52 35.92,29.52 BORON/ARGON/XENON.LI+
MISO
  Bottom 0.508: BORON/ARGON/XENON.MI 19.51,5.28 JP2.3
MOSI
  Bottom 0.508: BORON/ARGON/XENON.MO 22.05,5.28 JP2.4
N$1
  Top 0.305: U7.4 67.36,8.48 67.64,8.2 67.64,7.54 67.28,7.19 U7.2 U7.1
N$4  (via drill 0.35)
  Top 0.508: v53.26,28.27 51.65,29.88 R4.1 51.77,30.21 R5.2 51.77,33.64 53.31,35.19 v53.31,36.07
  Bottom 0.508: v53.31,36.07 55.09,36.07 SW2.P$1 | v53.26,28.27 55.12,28.27 SW2.P$2
N$14
  Top 0.305: U7.13 U7.12 60.49,7.82 59.46,7.82 59.38,7.9 59.38,8.99 59.53,9.13 | U7.10 59.53,9.13 | R11.1 58.83,13.38 58.83,9.83 59.53,9.13
N$16
  Top 0.508: R10.1 Q1.1
N$19
  Top 0.508: Q1.3 44.76,17.37 45.59,18.21 46.78,18.21 R12.2
N$24
  Top 0.508: C4.1 R11.2 57.17,13.52 S2.3
  Bottom 0.508: S2.4 S2.3
N$25  (via drill 0.35)
  Top 0.305: U7.8 U7.9 61.24,9.78 61.57,10.11 62.17,10.11 v62.2,10.08
  Top 0.508: R13.2 69.67,7.84 S2.2
  Bottom 0.305: v62.2,10.08 62.38,9.9 64.52,9.9 67.82,6.6 67.82,6.02
  Bottom 0.508: S2.1 67.82,6.02 S2.2
RESET  (via drill 0.35)
  Top 0.305: 33,18.59 JP7.2
  Top 0.508: 33,18.59 32.89,18.59 32.36,19.12 32.36,20.42 30.96,21.82 v29.62,21.82 | v25.73,21.79 v25.72,21.78 U2.6 24.17,19.84 R3.1 | v29.62,21.82
  Bottom 0.508: v29.62,21.82 29.59,21.79 v25.73,21.79
RX
  Bottom 0.508: J3.1 10.46,4.12 13.03,6.68 BORON/ARGON/XENON.RX
SCK
  Bottom 0.508: BORON/ARGON/XENON.SCK 24.59,5.28 JP2.5
SCL  (via drill 0.33)
  Top 0.508: JP1.4 19.33,35.48 20.55,34.27 20.55,32.74 | U3.6 10.19,21.92 11.43,23.16 11.43,26.44 10.64,27.23 | 20.55,32.74 20.55,31.98 20.17,31.6 20.15,31.61 G1.3 12.56,31.61 BORON/ARGON/XENON.SCL 9.7,28.75 R7.1 10.64,27.23 | v45.95,34.16 44.52,32.74 20.55,32.74 | 10.64,27.23
  Bottom 0.508: J2.1 v45.95,34.16
SDA  (via drill 0.35)
  Top 0.508: BORON/ARGON/XENON.SDA 7.95,29.93 11.53,33.51 16.79,33.51 | v7.21,23.19 U3.5 9.71,24.17 R6.1 | 16.79,33.51 G1.1 | JP1.5 16.79,33.51
  Bottom 0.508: BORON/ARGON/XENON.SDA 5.74,27.33 5.74,24.38 6.93,23.19 v7.21,23.19 | JP1.5 18.62,37.74 40.36,37.74 43.97,34.14 43.97,31.89 J2.2
SS
  Top 0.508: BORON/ARGON/XENON.A5 17.75,3.79 JP2.2
TEMP
  Top 0.508: U1.1 22.41,12.54 BORON/ARGON/XENON.A4
TX
  Bottom 0.508: J3.2 10.49,6.1 BORON/ARGON/XENON.TX | BORON/ARGON/XENON.TX
USER-SW
  Top 0.508: BORON/ARGON/XENON.D4 18.21,29.54 19.56,30.89 37.13,30.89 37.38,30.64 44.2,30.64 48.95,35.38 49.98,35.38 C3.1 50.01,35.42 R5.1
VCC
  Top 0.254: 31.04,7.11 30.66,7.11
  Top 0.305: 31.04,7.11 32.08,8.15 32.08,9.95 31.09,10.95 30.79,10.95 30.76,10.93 30.48,10.93 | 30.48,10.93 29.54,9.98 29.54,8.15 30.58,7.11 30.66,7.11 30.63,7.09 27.58,7.09 26.98,7.7 26.98,10.07 27.84,10.93 30.48,10.93
  Top 0.508: R4.2 51.44,26.62 43.43,18.62 43.43,13.72 42.42,12.7 42.42,12.57 | 6.71,27.23 R7.2 | 6.3,19.38 U3.8 10.69,17.42 C1.1 | 14.83,16.13 14.83,14.51 C2.1 | 18.44,16.13 18.39,16.18 18.39,17.96 19.3,18.87 JP9.2 22.39,18.87 R3.2 | U1.2 20.4,13.49 21.89,14.99 | R6.2 7.63,25.65 6.68,25.65 | U1.4 17.02,16.1 16.99,16.13
  Top 0.813: 30.79,10.95 30.79,13.47 | F2.1 8.05,32.23 5.66,29.84 5.66,28.22 6.68,27.2 | 6.68,27.2 6.71,27.23 | 6.68,27.2 6.68,25.65 5.71,24.69 5.71,19.96 6.3,19.38 5.64,18.72 5.64,15.47 6.64,14.46 12.85,14.46 12.93,14.54 12.93,15.6 13.46,16.13 14.83,16.13 16.99,16.13 18.44,16.13 20.75,16.13 21.89,14.99 22.4,14.48 29.77,14.48 30.79,13.47 | BORON/ARGON/XENON.3V3 43.43,9.3 43.43,11.56 42.42,12.57 41.52,13.47 30.79,13.47 | F3.1 32.29,7.11 30.66,7.11
VCC2-EXT  (via drill 0.5)
  Top 0.813: v41.94,34.67 41.96,34.7 41.96,35.89 40.26,37.59 16.18,37.59 JP1.6 13.73,36.18 V2.2 10.42,36.2 F2.2
  Bottom 0.813: v41.94,34.67 41.94,31.89 J2.3
VCC-EXT  (via drill 0.5)
  Top 0.813: JP2.6 27.13,5.26 27.47,5.6 V3.2 31,5.6 F3.2 35.25,1.35 41.33,1.35 41.94,1.96 41.94,2.06 v41.96,2.08
  Bottom 0.813: J1.2 41.95,2.09 v41.96,2.08
VDD
  Top 0.508: U2.1 24.94,16.36 22.71,16.36 21.49,17.58 JP9.1
VUSB  (via drill 0.5)
  Top 0.508: D3.ANODE 65.53,21.34
  Top 0.813: 65.53,21.34 65.53,22.89 v65.48,22.94 | D3.ANODE 66.42,20.44 73.62,20.44 V1.2 76.74,20.48 F1.2 76.78,11.76 v77.14,11.4
  Bottom 0.813: v65.48,22.94 43.64,22.94 38.61,27.96 31.7,27.96 30.81,28.85 BORON/ARGON/XENON.VUSB | v77.14,11.4 77.6,10.95 C8.P$1
WAKE
  Top 0.508: U2.5 26.67,24.5 28.27,26.1 BORON/ARGON/XENON.D8

### Text on the board
bNames: GND D3 D2 SCL SDA Vcc | SCL SDA VCC GND | v1.0- 4-15-19 | chip@seeinsights.com | + | + | User Btn | LiPO Battery | 5-6V @ 10W | Rx Tx | Power - Push On / Push Off | 1 Hour Watchdog | Vcc SCK MO MI SS GND | A1 A0 Vcc GND